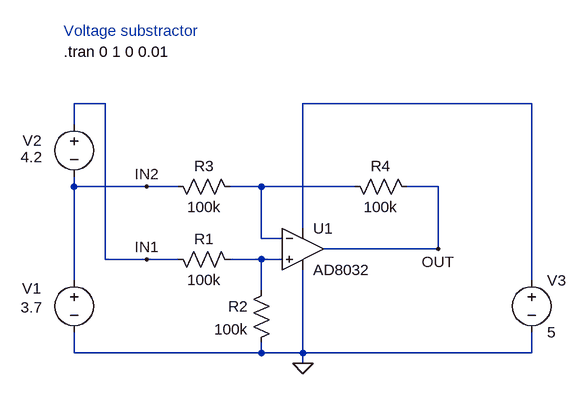
[diagram p0: schematic Voltage_subtractor.asc]
Voltage_subtractor.asc, the LTspice schematic file:
Version 4
SHEET 1 880 680
WIRE -96 -80 -144 -80
WIRE 560 -80 208 -80
WIRE -144 -48 -144 -80
WIRE -144 48 -144 32
WIRE -32 48 -144 48
WIRE 16 48 -32 48
WIRE 144 48 96 48
WIRE 288 48 144 48
WIRE 416 48 368 48
WIRE 208 112 208 -80
WIRE 144 128 144 48
WIRE 176 128 144 128
WIRE 416 144 416 48
WIRE 416 144 240 144
WIRE -96 160 -96 -80
WIRE -32 160 -96 160
WIRE 16 160 -32 160
WIRE 144 160 96 160
WIRE 176 160 144 160
WIRE -144 192 -144 48
WIRE 560 192 560 -80
WIRE 144 208 144 160
WIRE -144 304 -144 272
WIRE 144 304 144 288
WIRE 144 304 -144 304
WIRE 208 304 208 176
WIRE 208 304 144 304
WIRE 560 304 560 272
WIRE 560 304 208 304
WIRE 208 320 208 304
FLAG 208 320 0
FLAG 416 144 OUT
FLAG -32 160 IN1
FLAG -32 48 IN2
SYMBOL OpAmps\\AD8032 208 80 R0
SYMATTR InstName U1
SYMBOL res 112 176 M270
WINDOW 0 32 56 VTop 2
WINDOW 3 0 56 VBottom 2
SYMATTR InstName R1
SYMATTR Value 100k
SYMBOL res 160 192 M0
SYMATTR InstName R2
SYMATTR Value 100k
SYMBOL res 0 32 M90
WINDOW 0 0 56 VBottom 2
WINDOW 3 32 56 VTop 2
SYMATTR InstName R3
SYMATTR Value 100k
SYMBOL res 272 32 M90
WINDOW 0 0 56 VBottom 2
WINDOW 3 32 56 VTop 2
SYMATTR InstName R4
SYMATTR Value 100k
SYMBOL voltage -144 176 R0
WINDOW 0 -80 29 Left 2
WINDOW 3 -82 58 Left 2
WINDOW 123 0 0 Left 0
WINDOW 39 0 0 Left 0
SYMATTR InstName V1
SYMATTR Value 3.7
SYMBOL voltage -144 -64 R0
WINDOW 0 -79 41 Left 2
WINDOW 3 -82 66 Left 2
WINDOW 123 0 0 Left 0
WINDOW 39 0 0 Left 0
SYMATTR InstName V2
SYMATTR Value 4.2
SYMBOL voltage 560 176 R0
WINDOW 123 0 0 Left 0
WINDOW 39 0 0 Left 0
SYMATTR InstName V3
SYMATTR Value 5
TEXT -160 -192 Left 2 ;Voltage substractor
TEXT -160 -160 Left 2 !.tran 0 1 0 0.01

The netlist it stands for:
* Voltage_subtractor.asc
XU1 N003 N002 N001 0 OUT AD8032  ; pins In+ In- V+ V- OUT
R1 N003 IN1 100k
R2 N003 0 100k
R3 IN2 N002 100k
R4 N002 OUT 100k
V1 IN2 0 3.7
V2 IN1 IN2 4.2
V3 N001 0 5
* Voltage substractor
.tran 0 1 0 0.01
.backanno
.end